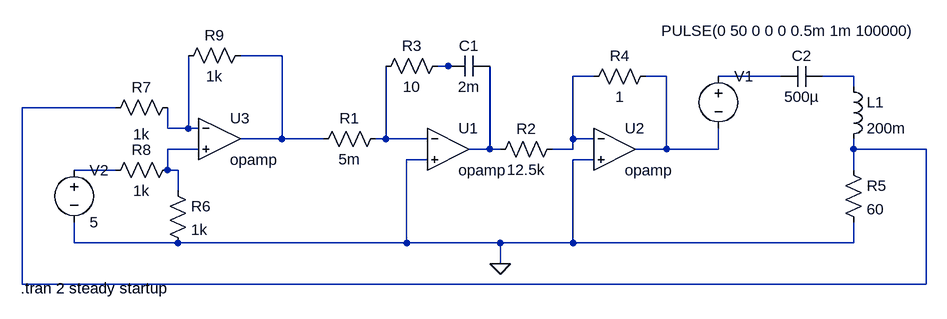
[diagram p0: schematic Draft3.asc]
Draft3.asc, the LTspice schematic file:
Version 4
SHEET 1 1016 680
WIRE -96 32 -160 32
WIRE 160 48 144 48
WIRE 176 48 160 48
WIRE 384 64 352 64
WIRE 496 64 464 64
WIRE 672 64 576 64
WIRE 784 64 736 64
WIRE 784 80 784 64
WIRE -352 112 -496 112
WIRE -272 144 -272 112
WIRE -240 144 -240 32
WIRE -240 144 -272 144
WIRE -224 144 -240 144
WIRE -96 160 -96 32
WIRE -96 160 -160 160
WIRE -32 160 -96 160
WIRE 64 160 64 48
WIRE 64 160 48 160
WIRE 128 160 64 160
WIRE 352 160 352 64
WIRE 384 160 352 160
WIRE -224 176 -272 176
WIRE 224 176 224 48
WIRE 224 176 192 176
WIRE 240 176 224 176
WIRE 352 176 352 160
WIRE 352 176 320 176
WIRE 496 176 496 64
WIRE 496 176 448 176
WIRE 576 176 576 144
WIRE 576 176 496 176
WIRE 784 176 784 160
WIRE 896 176 784 176
WIRE 128 192 96 192
WIRE 384 192 352 192
WIRE -352 208 -416 208
WIRE -272 208 -272 176
WIRE -256 208 -272 208
WIRE 784 208 784 176
WIRE -256 240 -256 208
WIRE -416 320 -416 288
WIRE -256 320 -416 320
WIRE 96 320 96 192
WIRE 96 320 -256 320
WIRE 240 320 96 320
WIRE 352 320 352 192
WIRE 352 320 240 320
WIRE 784 320 784 288
WIRE 784 320 352 320
WIRE 240 352 240 320
WIRE -496 384 -496 112
WIRE 896 384 896 176
WIRE 896 384 -496 384
FLAG 240 352 0
SYMBOL OpAmps\\opamp 160 112 R0
SYMATTR InstName U1
SYMBOL OpAmps\\opamp 416 112 R0
SYMATTR InstName U2
SYMBOL res 64 144 R90
WINDOW 0 0 56 VBottom 2
WINDOW 3 32 56 VTop 2
SYMATTR InstName R1
SYMATTR Value 5m
SYMBOL res 336 160 R90
WINDOW 0 0 56 VBottom 2
WINDOW 3 32 56 VTop 2
SYMATTR InstName R2
SYMATTR Value 12.5k
SYMBOL res 160 32 R90
WINDOW 0 0 56 VBottom 2
WINDOW 3 32 56 VTop 2
SYMATTR InstName R3
SYMATTR Value 10
SYMBOL res 480 48 R90
WINDOW 0 0 56 VBottom 2
WINDOW 3 32 56 VTop 2
SYMATTR InstName R4
SYMATTR Value 1
SYMBOL cap 224 32 R90
WINDOW 0 0 32 VBottom 2
WINDOW 3 32 32 VTop 2
SYMATTR InstName C1
SYMATTR Value 2m
SYMBOL res 768 192 R0
SYMATTR InstName R5
SYMATTR Value 60
SYMBOL ind 768 64 R0
SYMATTR InstName L1
SYMATTR Value 200m
SYMBOL cap 736 48 R90
WINDOW 0 0 32 VBottom 2
WINDOW 3 32 32 VTop 2
SYMATTR InstName C2
SYMATTR Value 500µ
SYMBOL OpAmps\\opamp -192 96 R0
SYMATTR InstName U3
SYMBOL res -272 224 R0
SYMATTR InstName R6
SYMATTR Value 1k
SYMBOL res -256 96 R90
WINDOW 0 0 56 VBottom 2
WINDOW 3 41 56 VTop 2
SYMATTR InstName R7
SYMATTR Value 1k
SYMBOL res -256 192 R90
WINDOW 0 0 56 VBottom 2
WINDOW 3 32 56 VTop 2
SYMATTR InstName R8
SYMATTR Value 1k
SYMBOL res -144 16 R90
WINDOW 0 0 56 VBottom 2
WINDOW 3 32 56 VTop 2
SYMATTR InstName R9
SYMATTR Value 1k
SYMBOL voltage 576 48 R0
WINDOW 3 -88 -54 Left 2
WINDOW 123 0 0 Left 0
WINDOW 39 0 0 Left 0
SYMATTR InstName V1
SYMATTR Value PULSE(0 50 0 0 0 0.5m 1m 100000)
SYMBOL voltage -416 192 R0
WINDOW 123 0 0 Left 0
WINDOW 39 0 0 Left 0
SYMATTR InstName V2
SYMATTR Value 5
TEXT -498 390 Left 2 !.tran 2 steady startup

The netlist it stands for:
* Draft3.asc
XU1 N009 0 N011 opamp Aol=100K GBW=10Meg  ; pins invin noninvin out
XU2 N003 0 N004 opamp Aol=100K GBW=10Meg  ; pins invin noninvin out
R1 N009 N001 5m
R2 N003 N011 12.5k
R3 N002 N009 10
R4 N004 N003 1
C1 N011 N002 2m
R5 N007 0 60
L1 N006 N007 200m
C2 N006 N005 500µ
XU3 N008 N010 N001 opamp Aol=100K GBW=10Meg  ; pins invin noninvin out
R6 N010 0 1k
R7 N008 N007 1k
R8 N010 N012 1k
R9 N001 N008 1k
V1 N005 N004 PULSE(0 50 0 0 0 0.5m 1m 100000)
V2 N012 0 5
.tran 2 steady startup
.backanno
.end